# Altium schematic sheet Mach_nguon_on_ap.SchDoc
size A; SheetNumber: 1; SheetTotal: 1
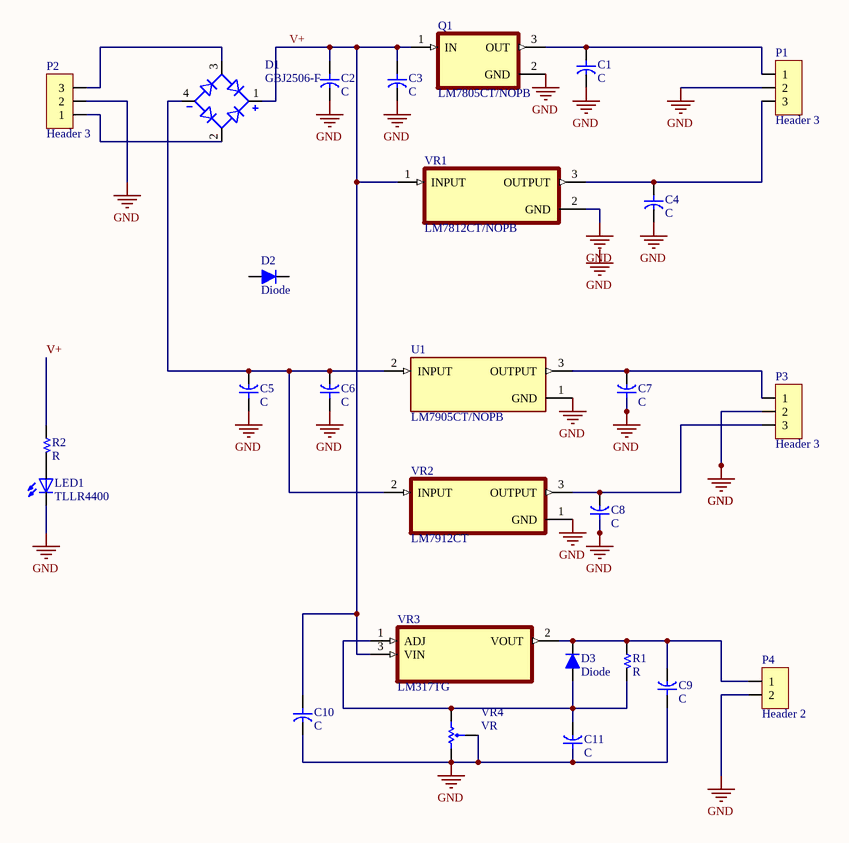
[diagram p0: Mach_nguon_on_ap.SchDoc]

## Parts
C1  C  [CYL/D.400/LS.200]
C2  C  [CYL/D.400/LS.200]
C3  C  [CYL/D.400/LS.200]
C4  C  [CYL/D.400/LS.200]
C5  C  [CYL/D.400/LS.200]
C6  C  [CYL/D.400/LS.200]
C7  C  [CYL/D.400/LS.200]
C8  C  [CYL/D.400/LS.200]
C9  C  [CYL/D.400/LS.200]
C10  C  [CYL/D.400/LS.200]
C11  C  [CYL/D.400/LS.200]
D1  GBJ2506-F  [DIOB_GBJ2506-F]
D2  Diode  [DO-35 (SOD27 )]
D3  Diode  [DO-35 (SOD27 )]
LED1  TLLR4400  [LED3MM]
P1  Header 3  [HDR/Terminal/3]
P2  Header 3  [HDR/Terminal/3]
P3  Header 3  [HDR/Terminal/3]
P4  Header 2  [HDR/Terminal/2]
Q1  LM7805CT/NOPB  [TO254P1054X470X2600-3]
R1  R  [R 1/4W/300]
R2  R  [R 1/4W/300]
U1  LM7905CT/NOPB  [TO254P1016X4575X1955-3]
VR1  LM7812CT/NOPB  [TO254P1054X470X1955-3]
VR2  LM7912CT  [TO254P1054X470X1955-3]
VR3  LM317TG  [TO254P1054X470X1955-3]
VR4  VR  [R VAR B]

## Nets
GND: C1.2 C2.2 C3.2 C4.2 C5.1 C6.1 C7.1 C8.1 C9.1 C10.2 C11.1 LED1.K(C) P1.2 P2.2 P3.2 P4.2 Q1.2(GND) U1.1(GND) VR1.2(GND) VR2.1(GND) VR4.2 VR4.3
V+: C2.1 C3.1 C10.1 D1.1(POS) Q1.1(IN) R2.1 VR1.1(INPUT) VR3.3(VIN)
NetC1_1: C1.1 P1.1 Q1.3(OUT)
NetC4_1: C4.1 P1.3 VR1.3(OUTPUT)
NetC5_2: C5.2 C6.2 D1.4(NEG) U1.2(INPUT) VR2.2(INPUT)
NetC7_2: C7.2 P3.1 U1.3(OUTPUT)
NetC8_2: C8.2 P3.3 VR2.3(OUTPUT)
NetC9_2: C9.2 D3.2(K) P4.1 R1.1 VR3.2(VOUT)
NetC11_2: C11.2 D3.1(A) R1.2 VR3.1(ADJ) VR4.1
NetD1_2: D1.2(AC1) P2.1
NetD1_3: D1.3(AC2) P2.3
NetLED1_A: LED1.A R2.2

Not connected (* = marked no-connect by the designer): D2 1(A) 2(K)

## Notes on the sheet
- Labels drawn without touching a wire or pin: GND

## Library data of the parts
C1-C11 = Capacitor: Capacitor pol
D1 = GBJ2506-F: Bridge Rectifier Single Phase Standard 600 V Through Hole GBJ; MF: Diodes Inc.; SnapEDA_Link: https://www.snapeda.com/parts/GBJ2506-F/Diodes+Inc./view-part/?ref=snap; Purchase-URL: https://pricing.snapeda.com/search/part/GBJ2506-F/?ref=eda; Value: *; MP: GBJ2506-F; Availability: In Stock; Check_prices: https://www.snapeda.com/parts/GBJ2506-F/Diodes+Inc./view-part/?ref=eda; Package: SIP-4 Diodes Incorporated; Price: None
D2 D3 = Diode: Default Diode
LED1 = TLLR4400: Red 619nm LED Indication - Discrete 1.9V Radial; MF: Vishay; SnapEDA_Link: https://www.snapeda.com/parts/TLLR4400/Vishay+Semiconductor+Opto+Division/view-part/?ref=snap; Package: None; Value: *; MP: TLLR4400; Check_prices: https://www.snapeda.com/parts/TLLR4400/Vishay+Semiconductor+Opto+Division/view-part/?ref=eda
P1-P3 = Header 3: Header, 3-Pin
P4 = Header 2: Header, 2-Pin
Q1 = LM7805CT/NOPB: Linear Voltage Regulator IC Positive Fixed 1 Output 1.5A TO-220-3; MF: ON Semiconductor; Purchase-URL: https://pricing.snapeda.com/search/part/LM7805CT/?ref=eda; Check_prices: https://www.snapeda.com/parts/LM7805CT/Onsemi/view-part/?ref=eda; SnapEDA_Link: https://www.snapeda.com/parts/LM7805CT/Onsemi/view-part/?ref=snap; Price: None; Availability: In Stock; Package: TO-220-3 ON Semiconductor; MP: LM7805CT; Value: *
R1 R2 = Resistor
U1 = LM7905CT/NOPB: 1.5-A, negative linear voltage regulator; MF: Texas Instruments; SnapEDA_Link: https://www.snapeda.com/parts/LM7905CT/NOPB/Texas+Instruments/view-part/?ref=snap; Package: TO-220-3 Texas Instruments; Value: *; MP: LM7905CT/NOPB; Check_prices: https://www.snapeda.com/parts/LM7905CT/NOPB/Texas+Instruments/view-part/?ref=eda
VR1 = LM7812CT/NOPB: 1.5-A, 30-V, linear voltage regulator; MF: Texas Instruments; SnapEDA_Link: https://www.snapeda.com/parts/LM7812CT/NOPB/Texas+Instruments/view-part/?ref=snap; Package: TO-220-3 Texas Instruments; Value: *; MP: LM7812CT/NOPB; Check_prices: https://www.snapeda.com/parts/LM7812CT/NOPB/Texas+Instruments/view-part/?ref=eda
VR2 = LM7912CT: 1.5-A, negative linear voltage regulator 3-TO-220 0 to 125; MF: Texas Instruments; SnapEDA_Link: https://www.snapeda.com/parts/LM7912CT/Texas+Instruments/view-part/?ref=snap; Package: TO-220-3 Texas Instruments; Value: *; MP: LM7912CT; Check_prices: https://www.snapeda.com/parts/LM7912CT/Texas+Instruments/view-part/?ref=eda
VR3 = LM317TG: Linear Voltage Regulator IC Positive Adjustable 1 Output 1.5A TO-220-3; MF: ON Semiconductor; SnapEDA_Link: https://www.snapeda.com/parts/LM317TG/Onsemi/view-part/?ref=snap; Package: TO-220-3 ON Semiconductor; Value: *; MP: LM317TG; Check_prices: https://www.snapeda.com/parts/LM317TG/Onsemi/view-part/?ref=eda
VR4 = Resistor Variable